# EAGLE schematic v7-flex2811_32x (EAGLE 7.3.0), part 2 of 2
## Sheet 25 of 32
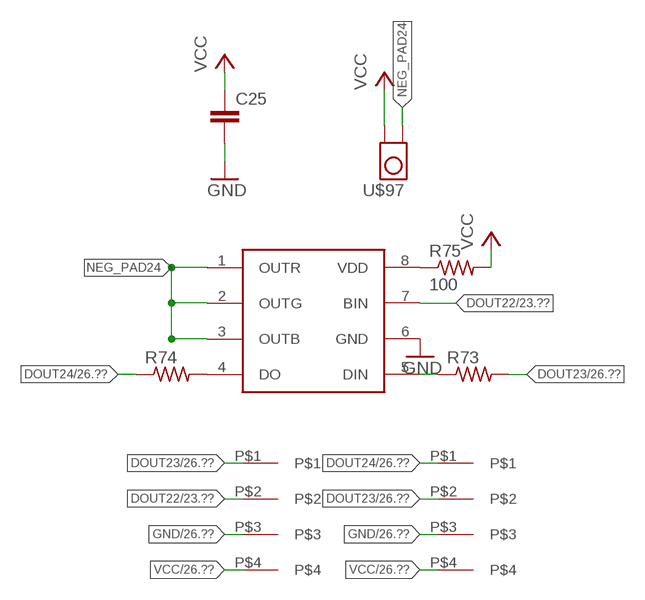
[diagram p24: schematic, sheet 25]

### Parts
C25  C-EUC0201  [C0201]
R73  R-US_R0201  [R0201]
R74  R-US_R0201  [R0201]
R75  100  R-US_R0201  [R0201]
U25  WS2818  [SO08]
U$97  TP_4MM_MED_PAD  [TP_4MM_MED_PAD]
U$99  4PAD  [4PAD]
U$100  4PAD  [4PAD]

### Nets
DOUT22: U25.7(BIN) U$99.P$2 ; also sheet 23,24
DOUT23: R73.2 U$99.P$1 U$100.P$2 ; also sheet 24,26
DOUT24: R74.1 U$100.P$1 ; also sheet 26,27
GND: C25.2 U25.6(GND) U$99.P$3 U$100.P$3 ; also sheet 1,2,3,4,5,6,7,8,9,10,11,12,13,14,15,16,17,18,19,20,21,22,23,24,26,27,28,29,30,31,32
N$73: R73.1 U25.5(DIN)
N$74: R74.2 U25.4(DO)
N$75: R75.1 U25.8(VDD)
NEG_PAD24: U25.1(OUTR) U25.2(OUTG) U25.3(OUTB) U$97.P$1
VCC: C25.1 R75.2 U$97.P$2 U$99.P$4 U$100.P$4 ; also sheet 1,2,3,4,5,6,7,8,9,10,11,12,13,14,15,16,17,18,19,20,21,22,23,24,26,27,28,29,30,31,32

## Sheet 26 of 32
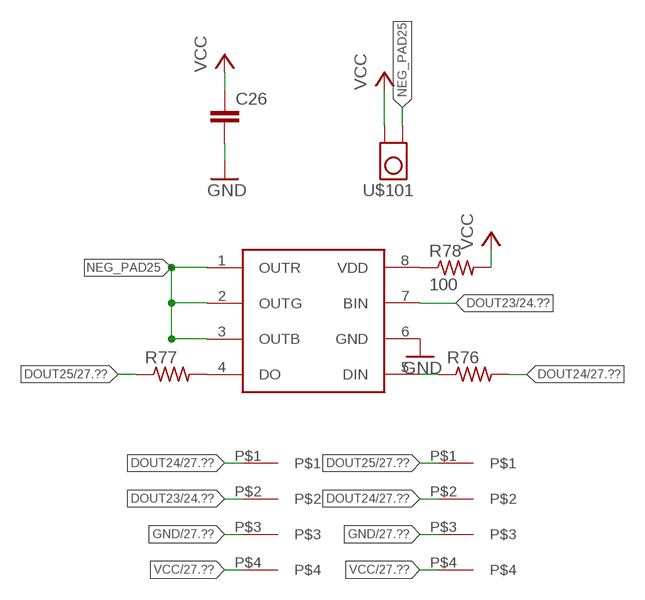
[diagram p25: schematic, sheet 26]

### Parts
C26  C-EUC0201  [C0201]
R76  R-US_R0201  [R0201]
R77  R-US_R0201  [R0201]
R78  100  R-US_R0201  [R0201]
U26  WS2818  [SO08]
U$101  TP_4MM_MED_PAD  [TP_4MM_MED_PAD]
U$103  4PAD  [4PAD]
U$104  4PAD  [4PAD]

### Nets
DOUT23: U26.7(BIN) U$103.P$2 ; also sheet 24,25
DOUT24: R76.2 U$103.P$1 U$104.P$2 ; also sheet 25,27
DOUT25: R77.1 U$104.P$1 ; also sheet 27,28
GND: C26.2 U26.6(GND) U$103.P$3 U$104.P$3 ; also sheet 1,2,3,4,5,6,7,8,9,10,11,12,13,14,15,16,17,18,19,20,21,22,23,24,25,27,28,29,30,31,32
N$76: R76.1 U26.5(DIN)
N$77: R77.2 U26.4(DO)
N$78: R78.1 U26.8(VDD)
NEG_PAD25: U26.1(OUTR) U26.2(OUTG) U26.3(OUTB) U$101.P$1
VCC: C26.1 R78.2 U$101.P$2 U$103.P$4 U$104.P$4 ; also sheet 1,2,3,4,5,6,7,8,9,10,11,12,13,14,15,16,17,18,19,20,21,22,23,24,25,27,28,29,30,31,32

## Sheet 27 of 32
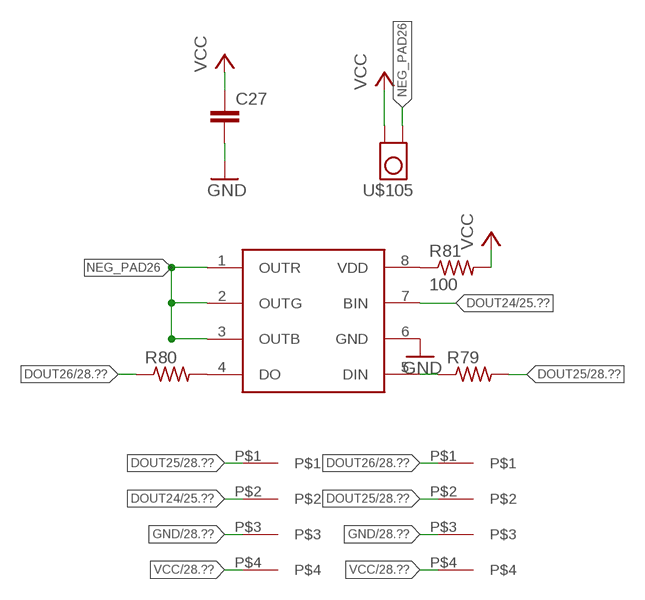
[diagram p26: schematic, sheet 27]

### Parts
C27  C-EUC0201  [C0201]
R79  R-US_R0201  [R0201]
R80  R-US_R0201  [R0201]
R81  100  R-US_R0201  [R0201]
U27  WS2818  [SO08]
U$105  TP_4MM_MED_PAD  [TP_4MM_MED_PAD]
U$107  4PAD  [4PAD]
U$108  4PAD  [4PAD]

### Nets
DOUT24: U27.7(BIN) U$107.P$2 ; also sheet 25,26
DOUT25: R79.2 U$107.P$1 U$108.P$2 ; also sheet 26,28
DOUT26: R80.1 U$108.P$1 ; also sheet 28,29
GND: C27.2 U27.6(GND) U$107.P$3 U$108.P$3 ; also sheet 1,2,3,4,5,6,7,8,9,10,11,12,13,14,15,16,17,18,19,20,21,22,23,24,25,26,28,29,30,31,32
N$79: R79.1 U27.5(DIN)
N$80: R80.2 U27.4(DO)
N$81: R81.1 U27.8(VDD)
NEG_PAD26: U27.1(OUTR) U27.2(OUTG) U27.3(OUTB) U$105.P$1
VCC: C27.1 R81.2 U$105.P$2 U$107.P$4 U$108.P$4 ; also sheet 1,2,3,4,5,6,7,8,9,10,11,12,13,14,15,16,17,18,19,20,21,22,23,24,25,26,28,29,30,31,32

## Sheet 28 of 32
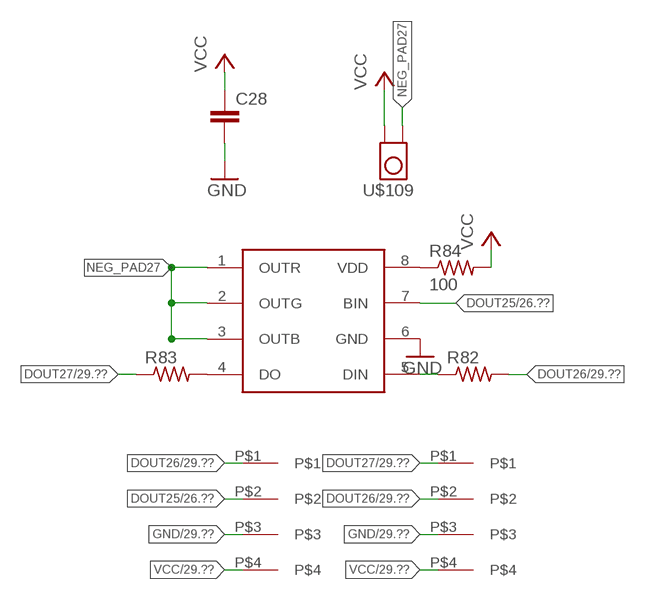
[diagram p27: schematic, sheet 28]

### Parts
C28  C-EUC0201  [C0201]
R82  R-US_R0201  [R0201]
R83  R-US_R0201  [R0201]
R84  100  R-US_R0201  [R0201]
U28  WS2818  [SO08]
U$109  TP_4MM_MED_PAD  [TP_4MM_MED_PAD]
U$111  4PAD  [4PAD]
U$112  4PAD  [4PAD]

### Nets
DOUT25: U28.7(BIN) U$111.P$2 ; also sheet 26,27
DOUT26: R82.2 U$111.P$1 U$112.P$2 ; also sheet 27,29
DOUT27: R83.1 U$112.P$1 ; also sheet 29,30
GND: C28.2 U28.6(GND) U$111.P$3 U$112.P$3 ; also sheet 1,2,3,4,5,6,7,8,9,10,11,12,13,14,15,16,17,18,19,20,21,22,23,24,25,26,27,29,30,31,32
N$82: R82.1 U28.5(DIN)
N$83: R83.2 U28.4(DO)
N$84: R84.1 U28.8(VDD)
NEG_PAD27: U28.1(OUTR) U28.2(OUTG) U28.3(OUTB) U$109.P$1
VCC: C28.1 R84.2 U$109.P$2 U$111.P$4 U$112.P$4 ; also sheet 1,2,3,4,5,6,7,8,9,10,11,12,13,14,15,16,17,18,19,20,21,22,23,24,25,26,27,29,30,31,32

## Sheet 29 of 32
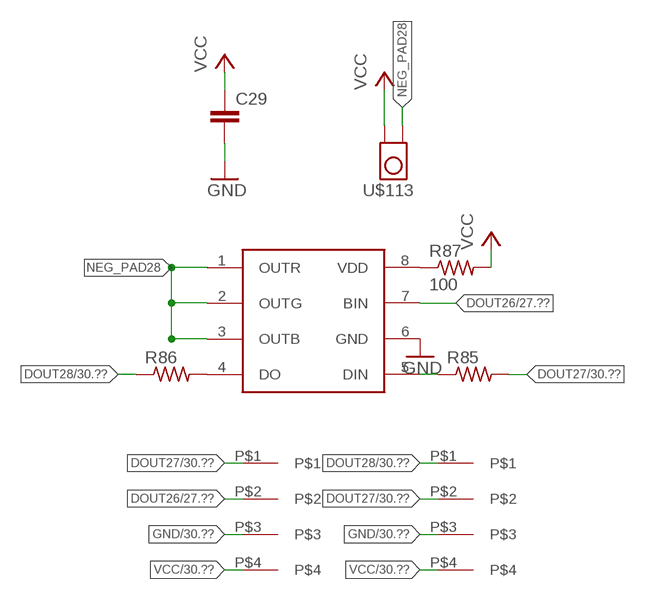
[diagram p28: schematic, sheet 29]

### Parts
C29  C-EUC0201  [C0201]
R85  R-US_R0201  [R0201]
R86  R-US_R0201  [R0201]
R87  100  R-US_R0201  [R0201]
U29  WS2818  [SO08]
U$113  TP_4MM_MED_PAD  [TP_4MM_MED_PAD]
U$115  4PAD  [4PAD]
U$116  4PAD  [4PAD]

### Nets
DOUT26: U29.7(BIN) U$115.P$2 ; also sheet 27,28
DOUT27: R85.2 U$115.P$1 U$116.P$2 ; also sheet 28,30
DOUT28: R86.1 U$116.P$1 ; also sheet 30,31
GND: C29.2 U29.6(GND) U$115.P$3 U$116.P$3 ; also sheet 1,2,3,4,5,6,7,8,9,10,11,12,13,14,15,16,17,18,19,20,21,22,23,24,25,26,27,28,30,31,32
N$85: R85.1 U29.5(DIN)
N$86: R86.2 U29.4(DO)
N$87: R87.1 U29.8(VDD)
NEG_PAD28: U29.1(OUTR) U29.2(OUTG) U29.3(OUTB) U$113.P$1
VCC: C29.1 R87.2 U$113.P$2 U$115.P$4 U$116.P$4 ; also sheet 1,2,3,4,5,6,7,8,9,10,11,12,13,14,15,16,17,18,19,20,21,22,23,24,25,26,27,28,30,31,32

## Sheet 30 of 32
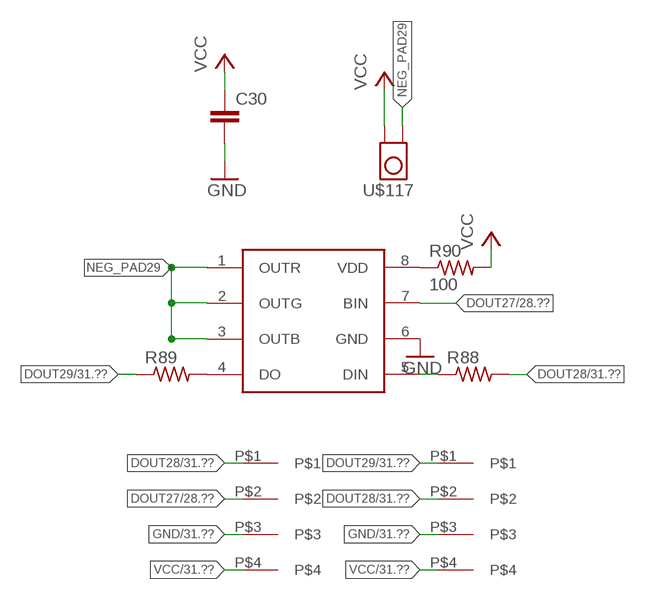
[diagram p29: schematic, sheet 30]

### Parts
C30  C-EUC0201  [C0201]
R88  R-US_R0201  [R0201]
R89  R-US_R0201  [R0201]
R90  100  R-US_R0201  [R0201]
U30  WS2818  [SO08]
U$117  TP_4MM_MED_PAD  [TP_4MM_MED_PAD]
U$119  4PAD  [4PAD]
U$120  4PAD  [4PAD]

### Nets
DOUT27: U30.7(BIN) U$119.P$2 ; also sheet 28,29
DOUT28: R88.2 U$119.P$1 U$120.P$2 ; also sheet 29,31
DOUT29: R89.1 U$120.P$1 ; also sheet 31,32
GND: C30.2 U30.6(GND) U$119.P$3 U$120.P$3 ; also sheet 1,2,3,4,5,6,7,8,9,10,11,12,13,14,15,16,17,18,19,20,21,22,23,24,25,26,27,28,29,31,32
N$88: R88.1 U30.5(DIN)
N$89: R89.2 U30.4(DO)
N$90: R90.1 U30.8(VDD)
NEG_PAD29: U30.1(OUTR) U30.2(OUTG) U30.3(OUTB) U$117.P$1
VCC: C30.1 R90.2 U$117.P$2 U$119.P$4 U$120.P$4 ; also sheet 1,2,3,4,5,6,7,8,9,10,11,12,13,14,15,16,17,18,19,20,21,22,23,24,25,26,27,28,29,31,32

## Sheet 31 of 32
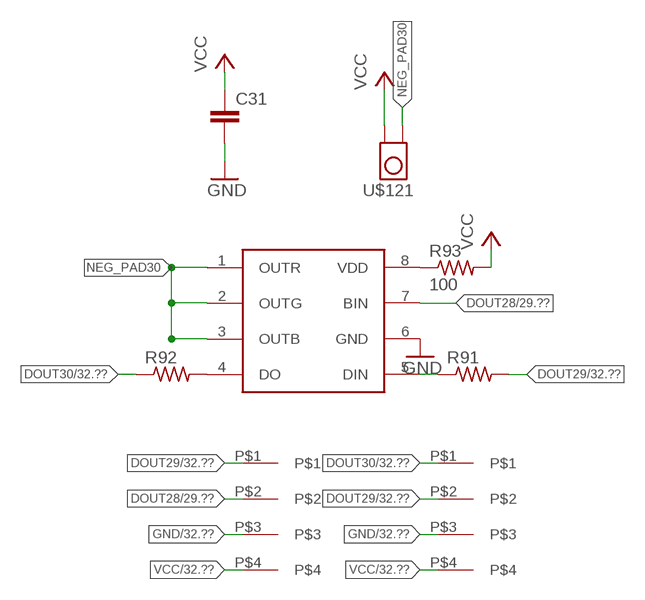
[diagram p30: schematic, sheet 31]

### Parts
C31  C-EUC0201  [C0201]
R91  R-US_R0201  [R0201]
R92  R-US_R0201  [R0201]
R93  100  R-US_R0201  [R0201]
U31  WS2818  [SO08]
U$121  TP_4MM_MED_PAD  [TP_4MM_MED_PAD]
U$123  4PAD  [4PAD]
U$124  4PAD  [4PAD]

### Nets
DOUT28: U31.7(BIN) U$123.P$2 ; also sheet 29,30
DOUT29: R91.2 U$123.P$1 U$124.P$2 ; also sheet 30,32
DOUT30: R92.1 U$124.P$1 ; also sheet 32
GND: C31.2 U31.6(GND) U$123.P$3 U$124.P$3 ; also sheet 1,2,3,4,5,6,7,8,9,10,11,12,13,14,15,16,17,18,19,20,21,22,23,24,25,26,27,28,29,30,32
N$91: R91.1 U31.5(DIN)
N$92: R92.2 U31.4(DO)
N$93: R93.1 U31.8(VDD)
NEG_PAD30: U31.1(OUTR) U31.2(OUTG) U31.3(OUTB) U$121.P$1
VCC: C31.1 R93.2 U$121.P$2 U$123.P$4 U$124.P$4 ; also sheet 1,2,3,4,5,6,7,8,9,10,11,12,13,14,15,16,17,18,19,20,21,22,23,24,25,26,27,28,29,30,32

## Sheet 32 of 32
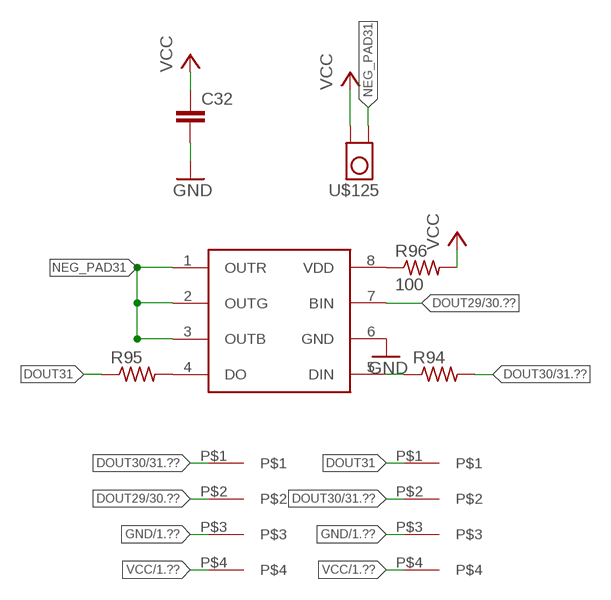
[diagram p31: schematic, sheet 32]

### Parts
C32  C-EUC0201  [C0201]
R94  R-US_R0201  [R0201]
R95  R-US_R0201  [R0201]
R96  100  R-US_R0201  [R0201]
U32  WS2818  [SO08]
U$125  TP_4MM_MED_PAD  [TP_4MM_MED_PAD]
U$127  4PAD  [4PAD]
U$128  4PAD  [4PAD]

### Nets
DOUT29: U32.7(BIN) U$127.P$2 ; also sheet 30,31
DOUT30: R94.2 U$127.P$1 U$128.P$2 ; also sheet 31
DOUT31: R95.1 U$128.P$1
GND: C32.2 U32.6(GND) U$127.P$3 U$128.P$3 ; also sheet 1,2,3,4,5,6,7,8,9,10,11,12,13,14,15,16,17,18,19,20,21,22,23,24,25,26,27,28,29,30,31
N$94: R94.1 U32.5(DIN)
N$95: R95.2 U32.4(DO)
N$96: R96.1 U32.8(VDD)
NEG_PAD31: U32.1(OUTR) U32.2(OUTG) U32.3(OUTB) U$125.P$1
VCC: C32.1 R96.2 U$125.P$2 U$127.P$4 U$128.P$4 ; also sheet 1,2,3,4,5,6,7,8,9,10,11,12,13,14,15,16,17,18,19,20,21,22,23,24,25,26,27,28,29,30,31

## Library data of the parts
C1-C32 = rcl:C-EU: CAPACITOR, European symbol
R1-R96 = rcl:R-US_: RESISTOR, American symbol
U1-U32 = Sparky:WS2818
U$1 U$5 U$9 U$13 U$17 U$21 U$25 U$29 U$33 U$37 U$41 U$45 U$49 U$53 U$57 U$61 U$65 U$69 U$73 U$77 U$81 U$85 U$89 U$93 U$97 U$101 U$105 U$109 U$113 U$117 U$121 U$125 = tom-tappytap-v5-flex:TP_4MM_MED_PAD
U$3 U$4 U$7 U$8 U$11 U$12 U$15 U$16 U$19 U$20 U$23 U$24 U$27 U$28 U$31 U$32 U$35 U$36 U$39 U$40 U$43 U$44 U$47 U$48 U$51 U$52 U$55 U$56 U$59 U$60 U$63 U$64 U$67 U$68 U$71 U$72 U$75 U$76 U$79 U$80 U$83 U$84 U$87 U$88 U$91 U$92 U$95 U$96 U$99 U$100 U$103 U$104 U$107 U$108 U$111 U$112 U$115 U$116 U$119 U$120 U$123 U$124 U$127 U$128 = Sparky:4PAD